# EAGLE design RT7258QW-break (EAGLE 6.6.0)
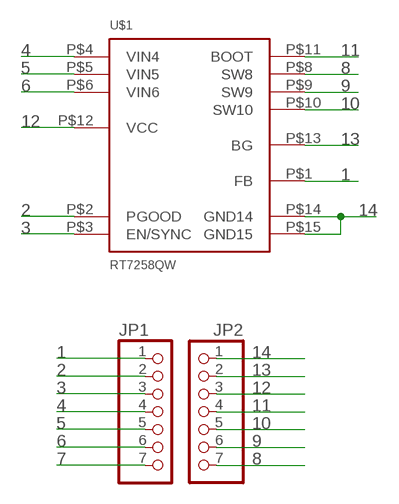
[diagram p0: schematic, sheet 1]

## Parts
JP1  PINHD-1X7  [1X07]
JP2  PINHD-1X7  [1X07]
U$1  RT7258QW  [RT7258GQW]

## Nets
1: JP1.1 U$1.P$1(FB)
2: JP1.2 U$1.P$2(PGOOD)
3: JP1.3 U$1.P$3(EN/SYNC)
4: JP1.4 U$1.P$4(VIN4)
5: JP1.5 U$1.P$5(VIN5)
6: JP1.6 U$1.P$6(VIN6)
7: JP1.7
8: JP2.7 U$1.P$8(SW8)
9: JP2.6 U$1.P$9(SW9)
10: JP2.5 U$1.P$10(SW10)
11: JP2.4 U$1.P$11(BOOT)
12: JP2.3 U$1.P$12(VCC)
13: JP2.2 U$1.P$13(BG)
14: JP2.1 U$1.P$14(GND14) U$1.P$15(GND15)

## Library data of the parts
JP1 JP2 = pinhead:PINHD-1X7: PIN HEADER
U$1 = PCR-IC:RT7258

## Board
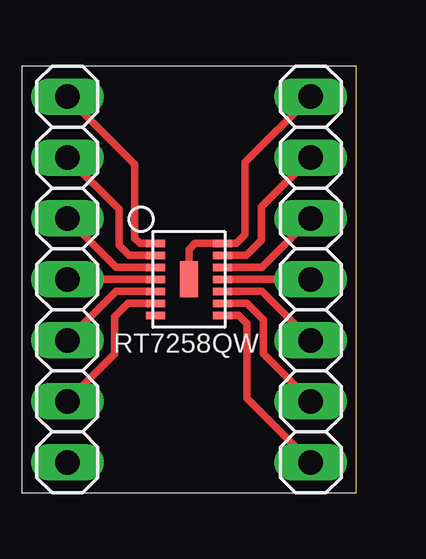
[diagram p1: board, top side]

Size 0 x 17.78 mm. Coordinates in mm from the lower left corner, seen from the top.
Outline: 0,0 0,17.78
Copper layers (1*16): Top 0.035mm / dielectric 1.5mm / Bottom 0.035mm
Design rules "default": minimum track width 10mil, minimum drill 24mil, track to track 8mil, track to pad 8mil, pad to pad 8mil, via to via 8mil, smd to smd 8mil, copper to edge 40mil, drill to drill 8mil, minimum pad ring 10mil, minimum via ring 8mil, stop-mask expansion 4mil, vias tented up to drill 0mil, thermal gap 10mil

### Footprints (pad centres in the part's own frame; a part is rotated, then mirrored left to right if it is on the bottom)
1X07 = drill 1.016 long: 1 -7.62,0; 2 -5.08,0; 3 -2.54,0; 4 0,0; 5 2.54,0; 6 5.08,0; 7 7.62,0
RT7258GQW = smd 0.3 x 0.8: P$1 -1.5,-1.4; P$2 -1,-1.4; P$3 -0.5,-1.4; P$4 0,-1.4; P$5 0.5,-1.4; P$6 1,-1.4; P$7 1.5,-1.4; P$8 1.5,1.4; P$9 1,1.4; P$10 0.5,1.4; P$11 0,1.4; P$12 -0.5,1.4; P$13 -1,1.4; P$14 -1.5,1.4 | smd 1.5 x 0.75: P$15 0,0

### Placement (x,y rotation side)
JP1  -12.07,8.89 270 top  (outside the outline)
JP2  -1.91,8.89 270 top
U$1  -6.99,8.89 270 top  (outside the outline)

### Tracks (layer width: path | path; a pad name or v marks a point on that pad's centre or on a via)
1
  Top 0.305: U$1.P$1 -9.02,10.39 -9.25,10.62 -9.25,13.69 JP1.1
2
  Top 0.305: U$1.P$2 -9.48,9.89 -9.91,10.31 -9.91,11.81 JP1.2
3
  Top 0.305: U$1.P$3 -10.03,9.39 JP1.3
4
  Top 0.305: U$1.P$4 JP1.4
5
  Top 0.305: U$1.P$5 -10.03,8.39 JP1.5
6
  Top 0.305: U$1.P$6 -9.53,7.89 -10.08,7.34 -10.08,5.79 JP1.6
8
  Top 0.305: U$1.P$8 -4.93,7.39 -4.57,7.04 -4.57,3.94 JP2.7
9
  Top 0.305: U$1.P$9 -4.56,7.89 -3.89,7.21 -3.89,5.79 JP2.6
10
  Top 0.305: U$1.P$10 -3.95,8.39 JP2.5
11
  Top 0.305: U$1.P$11 JP2.4
12
  Top 0.305: U$1.P$12 -3.95,9.39 JP2.3
13
  Top 0.305: U$1.P$13 -4.59,9.89 -3.96,10.52 -3.96,11.91 JP2.2
14
  Top 0.305: JP2.1 -4.65,13.77 -4.65,10.74 -5,10.39 U$1.P$14 -6.73,10.39 -6.99,10.14 U$1.P$15

### Text on the board
tPlace: RT7258QW